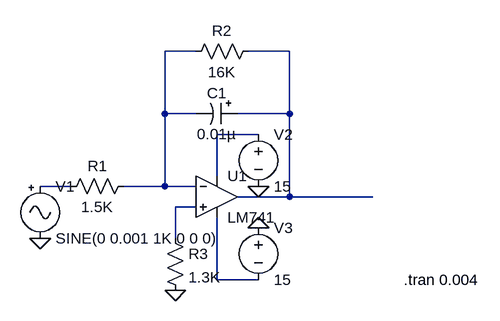
[diagram p0: schematic Integrator part-3 opamp.asc]
Integrator part-3 opamp.asc, the LTspice schematic file:
Version 4
SHEET 1 880 680
WIRE 368 96 320 96
WIRE 512 96 448 96
WIRE 320 192 320 96
WIRE 368 192 320 192
WIRE 512 192 512 96
WIRE 512 192 432 192
WIRE 464 224 400 224
WIRE 400 288 400 224
WIRE 176 304 128 304
WIRE 320 304 320 192
WIRE 320 304 256 304
WIRE 368 304 320 304
WIRE 512 320 512 192
WIRE 512 320 432 320
WIRE 640 320 512 320
WIRE 368 336 336 336
WIRE 336 384 336 336
WIRE 400 448 400 352
WIRE 464 448 400 448
FLAG 336 464 0
FLAG 464 368 0
FLAG 464 304 0
FLAG 128 384 0
SYMBOL LM741 400 256 R0
SYMATTR InstName U1
SYMBOL res 272 288 R90
WINDOW 0 0 56 VBottom 2
WINDOW 3 32 56 VTop 2
SYMATTR InstName R1
SYMATTR Value 1.5K
SYMBOL polcap 432 176 R90
WINDOW 0 0 32 VBottom 2
WINDOW 3 32 32 VTop 2
SYMATTR InstName C1
SYMATTR Value 0.01µ
SYMATTR Description Capacitor
SYMATTR Type cap
SYMATTR SpiceLine V=X Rser=4 Lser=0 mfg="   ---" pn="   ---" type="   ---"
SYMBOL Misc/signal 128 288 R0
SYMATTR InstName V1
SYMATTR Value SINE(0 0.001 1K 0 0 0)
SYMBOL voltage 464 208 R0
SYMATTR InstName V2
SYMATTR Value 15
SYMBOL voltage 464 352 R0
SYMATTR InstName V3
SYMATTR Value 15
SYMBOL res 464 80 R90
WINDOW 0 0 56 VBottom 2
WINDOW 3 32 56 VTop 2
SYMATTR InstName R2
SYMATTR Value 16K
SYMBOL res 320 368 R0
SYMATTR InstName R3
SYMATTR Value 1.3K
TEXT 688 448 Left 2 !.tran 0.004

The netlist it stands for:
* Integrator part-3 opamp.asc
XU1 N005 N001 N003 N006 N002 LM741  ; pins In+ In- V+ V- OUT
R1 N001 N004 1.5K
C1 N002 N001 0.01µ V=X Rser=4 Lser=0 mfg="   ---" pn="   ---" type="   ---"
V1 N004 0 SINE(0 0.001 1K 0 0 0)
V2 N003 0 15
V3 0 N006 15
R2 N002 N001 16K
R3 N005 0 1.3K
.tran 0.004
.lib LM741.lib
.backanno
.end